# Altium project c8t6第二版.PrjPcb
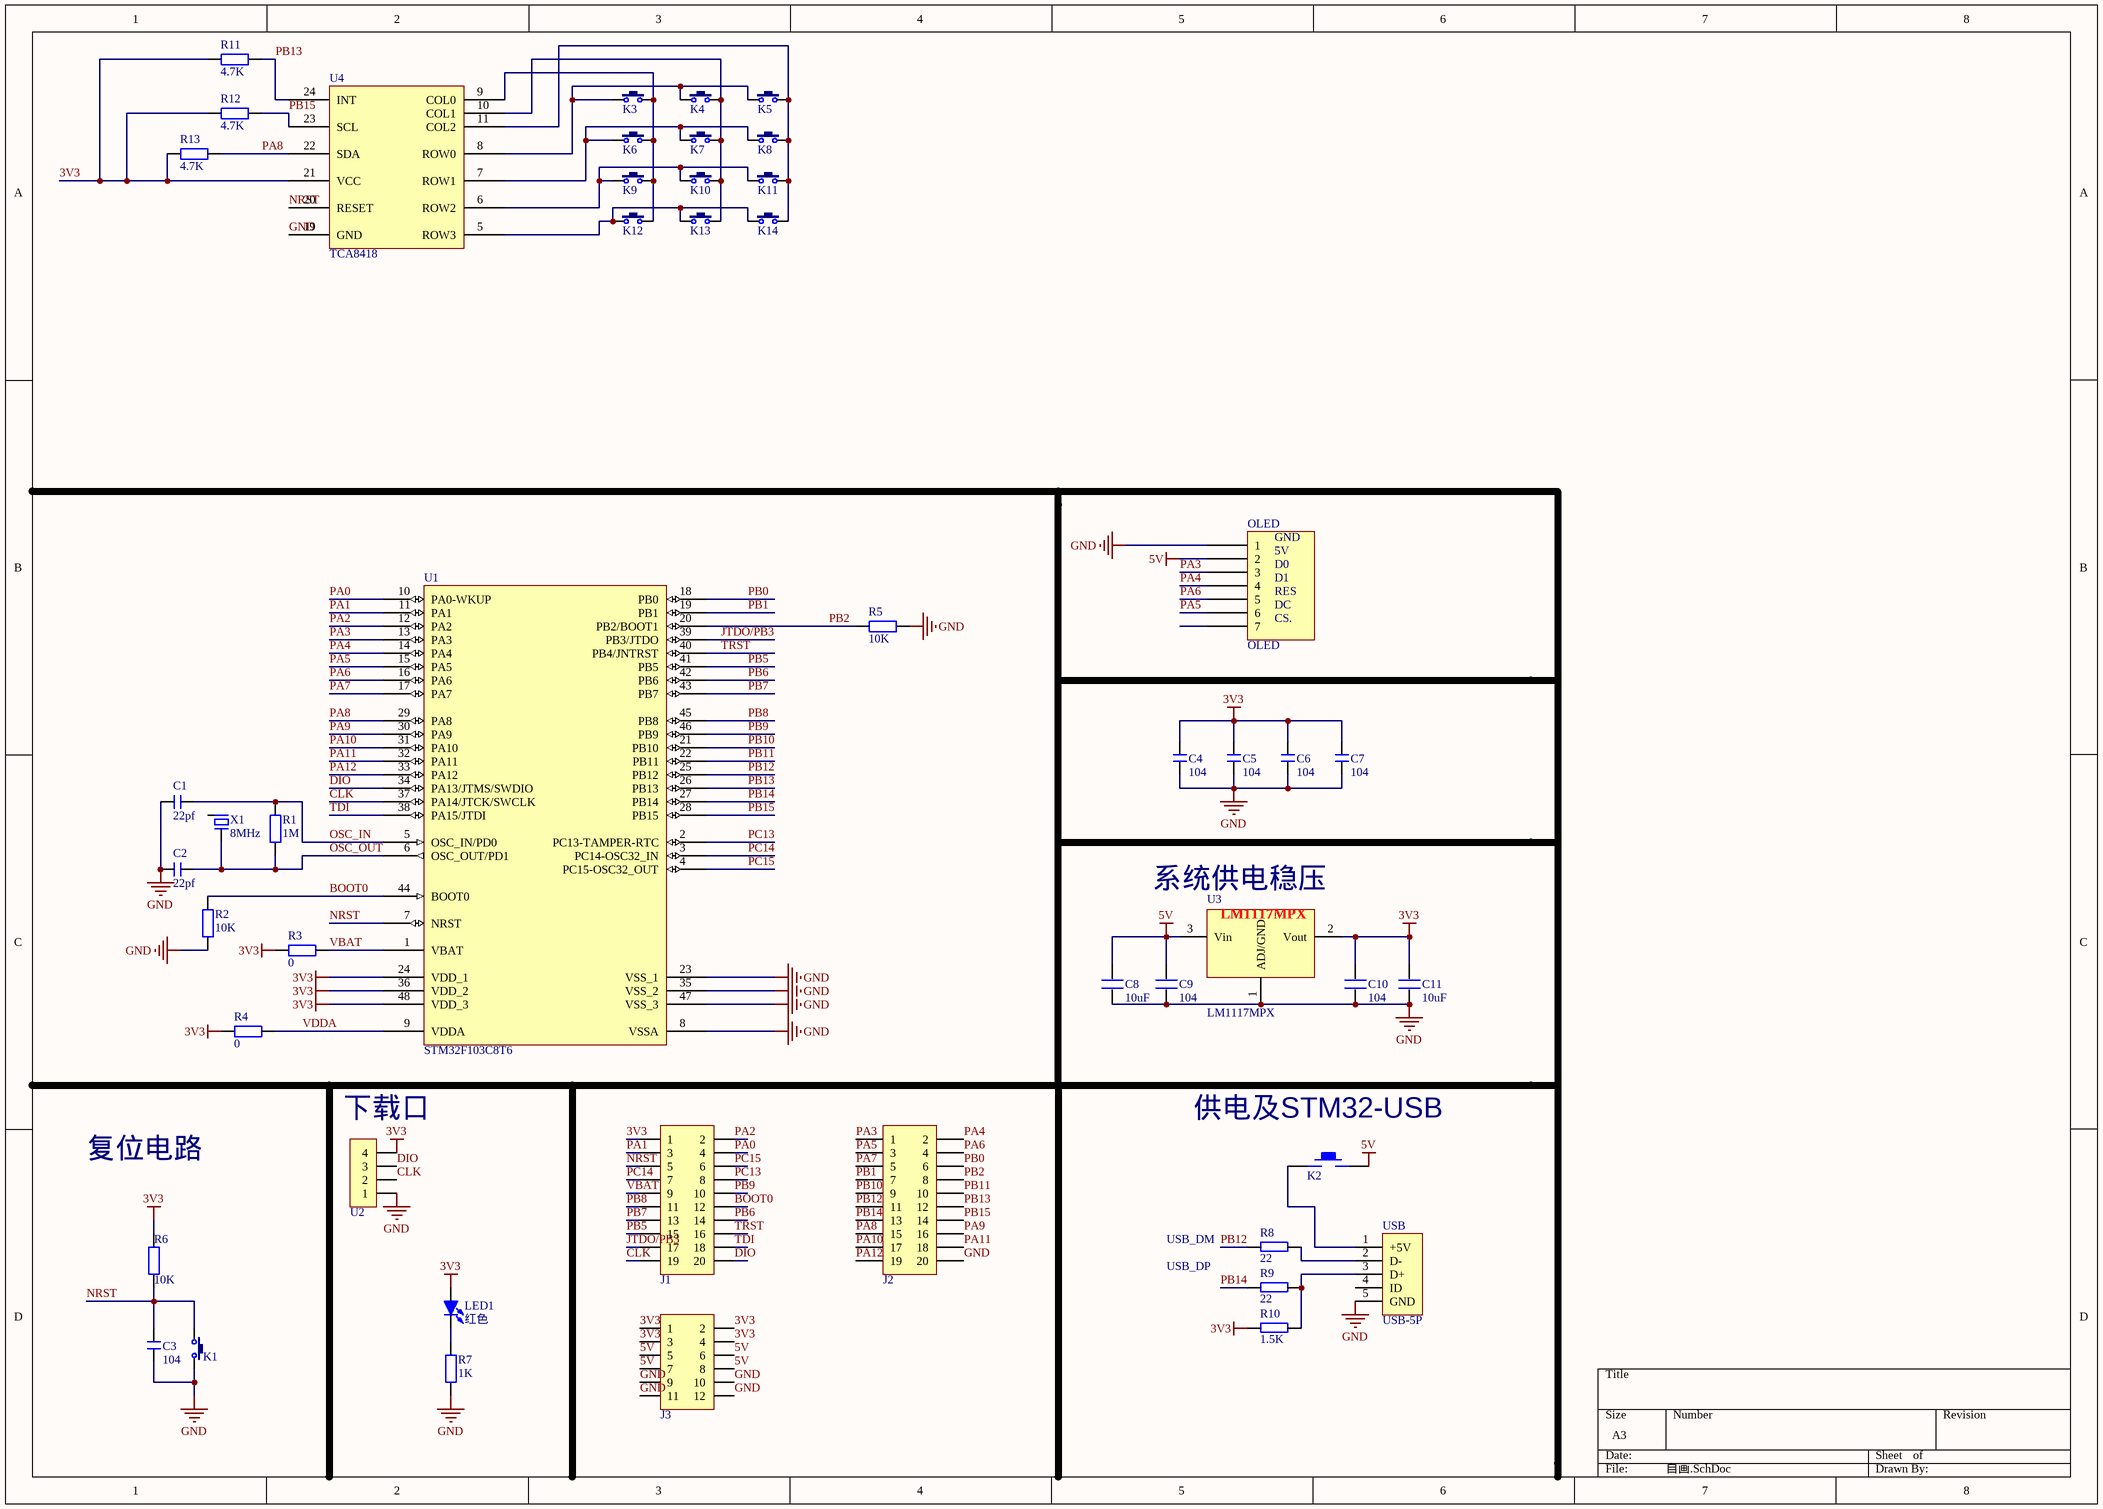
[diagram p0: 自画.SchDoc]
1 sheet, 49 parts. Net scope: global (net labels, ports and power ports of the same name join across sheets).
Board files: c8t6第二版.PcbDoc, logo.PcbDoc

## Sheet 自画.SchDoc
size A3

### Parts
C1  22pf  [C 0805]
C2  22pf  [C 0805]
C3  104  [C 0805]
C4  104  [C 0805]
C5  104  [C 0805]
C6  104  [C 0805]
C7  104  [C 0805]
C8  10uF  [C 0805]
C9  104  [C 0805]
C10  104  [C 0805]
C11  10uF  [C 0805]
J1  Header 2X10  [HDR-1X20]  (value not drawn)
J3  Header 6X2  [HDR-6X2]  (value not drawn)
K1  3x6x5  [TSW SMD-3*6*2.5]  (value not drawn)
K2  KEY_M  [CSW DIP-1P_G]  (value not drawn)
K3  3x6x5  [TSW SMD-3*6*2.5]  (value not drawn)
K4  3x6x5  [TSW SMD-3*6*2.5]  (value not drawn)
K5  3x6x5  [TSW SMD-3*6*2.5]  (value not drawn)
K6  3x6x5  [TSW SMD-3*6*2.5]  (value not drawn)
K7  3x6x5  [TSW SMD-3*6*2.5]  (value not drawn)
K8  3x6x5  [TSW SMD-3*6*2.5]  (value not drawn)
K9  3x6x5  [TSW SMD-3*6*2.5]  (value not drawn)
K10  3x6x5  [TSW SMD-3*6*2.5]  (value not drawn)
K11  3x6x5  [TSW SMD-3*6*2.5]  (value not drawn)
K12  3x6x5  [TSW SMD-3*6*2.5]  (value not drawn)
K13  3x6x5  [TSW SMD-3*6*2.5]  (value not drawn)
K14  3x6x5  [TSW SMD-3*6*2.5]  (value not drawn)
LED1  红色  [LED 0805G]
OLED  OLED  [HDR-1X7_M]
P?  J2  [HDR-1X20]
R1  1M  [R 0805]
R2  10K  [R 0805]
R3  0  [R 0805]
R4  0  [R 0805]
R5  10K  [R 0805]
R6  10K  [R 0805]
R7  1K  [R 0805]
R8  22  [R 0805]
R9  22  [R 0805]
R10  1.5K  [R 0805]
R11  4.7K  [R 0805]
R12  4.7K  [R 0805]
R13  4.7K  [R 0805]
U1  STM32F103C8T6  [LQFP48 7X7_M]
U2  HDR-1X4  [HDR-1X4]  (value not drawn)
U3  LM1117MPX  [SOT-223-4]
U4  TCA8418  [QFN24]
USB  USB-5P  [USB-MICRO_A]
X1  8MHz  [SMD5032-2]

### Nets
3V3: C4.2 C5.2 C6.2 C7.2 C10.2 C11.2 J1.1 J3.1 J3.2 J3.3 J3.4 LED1.1(A) R3.2 R4.2 R6.2 R10.2 R11.1 R12.1 R13.1 U1.24(VDD_1) U1.36(VDD_2) U1.48(VDD_3) U2.4 U3.2(Vout) U4.21(VCC)
5V: C8.2 C9.2 J3.5 J3.6 J3.7 J3.8 K2.2 OLED.2 U3.3(Vin)
GND: C1.1 C2.1 C3.1 C4.1 C5.1 C6.1 C7.1 C8.1 C9.1 C10.1 C11.1 J3.9 J3.10 J3.11 J3.12 K1.2 OLED.1 P?.20 R2.1 R5.2 R7.1 U1.8(VSSA) U1.23(VSS_1) U1.35(VSS_2) U1.47(VSS_3) U2.1 U3.1(ADJ/GND) U4.19(GND) USB.5(GND)
BOOT0: J1.12 R2.2 U1.44(BOOT0)
CLK: J1.19 U1.37(PA14/JTCK/SWCLK) U2.2
DIO: J1.20 U1.34(PA13/JTMS/SWDIO) U2.3
JTDO/PB3: J1.17 U1.39(PB3/JTDO)
NRST: C3.2 J1.5 K1.1 R6.1 U1.7(NRST) U4.20(RESET)
OSC_IN: C1.2 R1.2 U1.5(OSC_IN/PD0)
OSC_OUT: C2.2 R1.1 U1.6(OSC_OUT/PD1) X1.1
PA0: J1.4 U1.10(PA0-WKUP)
PA1: J1.3 U1.11(PA1)
PA2: J1.2 U1.12(PA2)
PA3: OLED.3 P?.1 U1.13(PA3)
PA4: OLED.4 P?.2 U1.14(PA4)
PA5: OLED.6 P?.3 U1.15(PA5)
PA6: OLED.5 P?.4 U1.16(PA6)
PA7: P?.5 U1.17(PA7)
PA8: P?.15 R13.2 U1.29(PA8) U4.22(SDA)
PA9: P?.16 U1.30(PA9)
PA10: P?.17 U1.31(PA10)
PA11: P?.18 U1.32(PA11)
PA12: P?.19 U1.33(PA12)
PB0: P?.6 U1.18(PB0)
PB1: P?.7 U1.19(PB1)
PB2: P?.8 R5.1 U1.20(PB2/BOOT1)
PB5: J1.15 U1.41(PB5)
PB6: J1.14 U1.42(PB6)
PB7: J1.13 U1.43(PB7)
PB8: J1.11 U1.45(PB8)
PB9: J1.10 U1.46(PB9)
PB10: P?.9 U1.21(PB10)
PB11: P?.10 U1.22(PB11)
PB12: P?.11 R8.2 U1.25(PB12)
PB13: P?.12 R11.2 U1.26(PB13) U4.24(INT)
PB14: P?.13 R9.2 U1.27(PB14)
PB15: P?.14 R12.2 U1.28(PB15) U4.23(SCL)
PC13: J1.8 U1.2(PC13-TAMPER-RTC)
PC14: J1.7 U1.3(PC14-OSC32_IN)
PC15: J1.6 U1.4(PC15-OSC32_OUT)
TDI: J1.18 U1.38(PA15/JTDI)
TRST: J1.16 U1.40(PB4/JNTRST)
VBAT: J1.9 R3.1 U1.1(VBAT)
VDDA: R4.1 U1.9(VDDA)
NetK2_1: K2.1 USB.1(+5V)
NetK3_1: K3.1 K4.1 K5.1 U4.8(ROW0)
NetK3_2: K3.2 K6.2 K9.2 K12.2 U4.9(COL0)
NetK4_2: K4.2 K7.2 K10.2 K13.2 U4.10(COL1)
NetK5_2: K5.2 K8.2 K11.2 K14.2 U4.11(COL2)
NetK6_1: K6.1 K7.1 K8.1 U4.7(ROW1)
NetK9_1: K9.1 K10.1 K11.1 U4.6(ROW2)
NetK12_1: K12.1 K13.1 K14.1 U4.5(ROW3)
NetLED1_2: LED1.2(K) R7.2
NetR8_1: R8.1 USB.2(D-)
NetR9_1: R9.1 R10.1 USB.3(D+)

Not connected (* = marked no-connect by the designer): OLED 7; USB 4(ID); X1 2

### Notes on the sheet
- (near U3) 系统供电稳压
- (near U2) 下载口
- (near K2) 供电及STM32-USB
- 复位电路
- USB_DM
- USB_DP
- (in symbol OLED) GND; 5V; D0; D1; RES; DC; CS.

### Library data of the parts
C1-C7 = C: 无极性贴片电容; 版权归属: 源创客; BOM名称: 无极性贴片电容; 学习资源: www.ooocke.com
C8-C11 = C
J1 = Header 10X2: 10*2P接插件; 版权归属: 源创客; BOM名称: 10*2P接插件; 学习资源: www.ooocke.com
J3 = Header  6X2: 6*2P接插件; 版权归属: 源创客; BOM名称: 6*2P接插件; 学习资源: www.ooocke.com
K1 K3-K14 = TSW 3x6: 3x6轻触开关; 版权归属: 源创客; BOM名称: 3x6轻触开关; 学习资源: www.ooocke.com
LED1 = LED-SMD: 贴片LED; 版权归属: 源创客; BOM名称: 贴片LED; 学习资源: www.ooocke.com
P? = Header 10X2: Header, 10-Pin, Dual row; LatestRevisionDate: 17-Jul-2002; LatestRevisionNote: Re-released for DXP Platform.; Publisher: Altium Limited
R1 = R-CRR: 直插色环电阻; BOM名称: 色环电阻; 版权归属: 源创客; 学习资源: www.ooocke.com
R2-R7 R11-R13 = R: 贴片电阻; 版权归属: 源创客; BOM名称: 贴片电阻; 学习资源: www.ooocke.com
R8-R10 = R
U1 = STM32F103C8T6: Flaah:64/RAM:20/IO:36; BOM名称: 32位STM单片机; 版权归属: 源创客; 学习资源: www.ooocke.com
U2 = Header 4: 4P接插件; 版权归属: 源创客; BOM名称: 4P接插件; 学习资源: www.ooocke.com
U3 = LM1117MPX: NS 800mA Low-Dropout Linear Regulator
U4 = Component_1
USB = USB-5P: 微型USB母座; 版权归属: 源创客; BOM名称: 微型USB母座; 学习资源: www.ooocke.com
X1 = XTAL-2: 2脚晶振; 版权归属: 源创客; BOM名称: 2脚晶振; 学习资源: www.ooocke.com